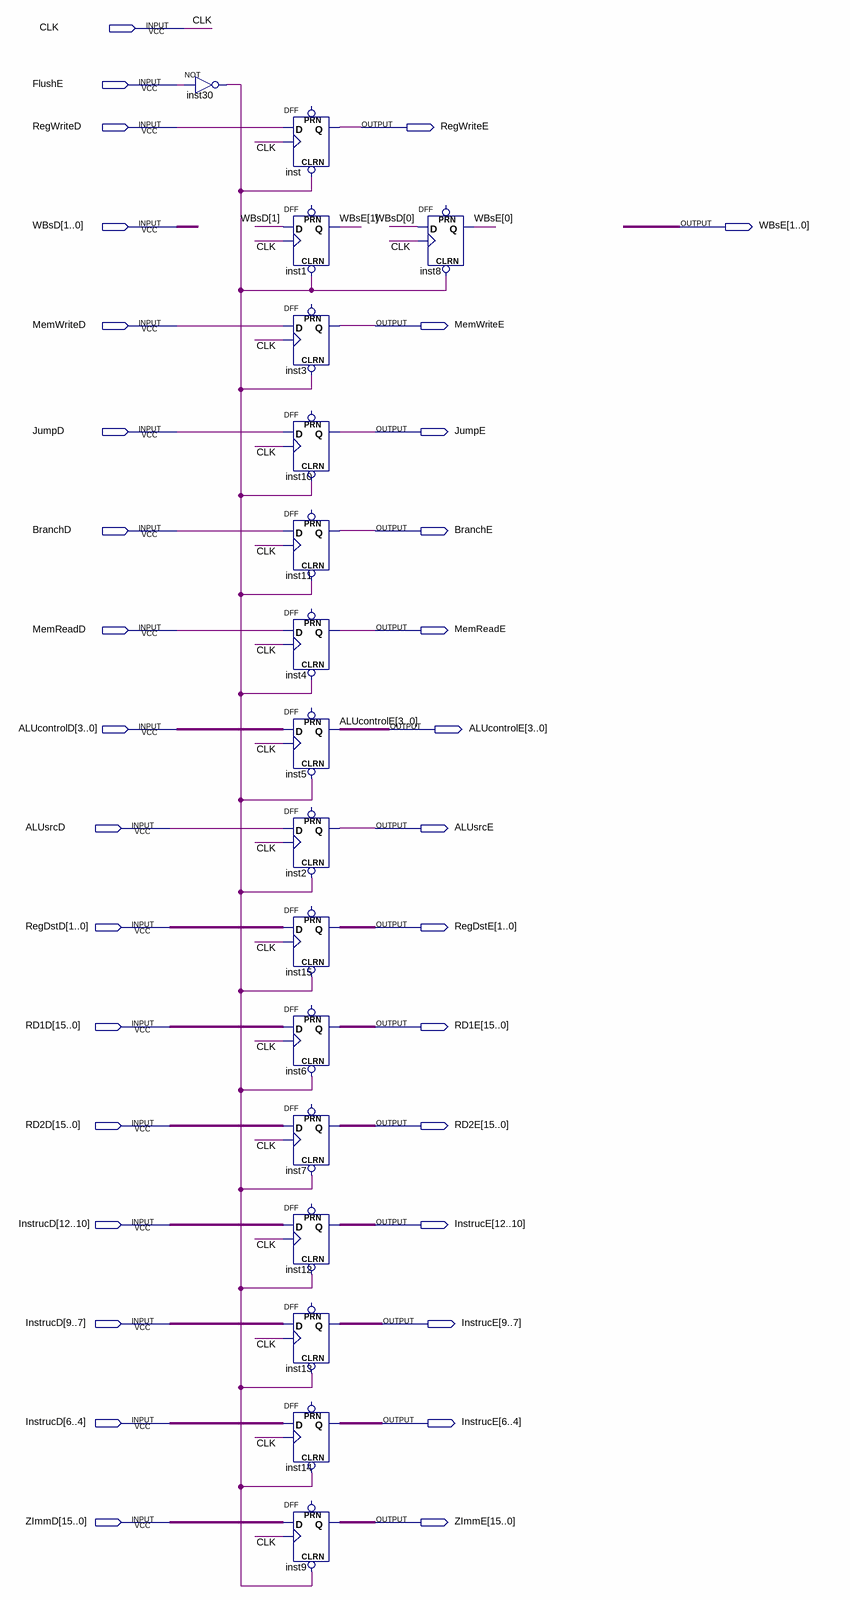
[diagram p0: schematic sheet]
// Quartus schematic ID_E.bdf as structural Verilog: 17 symbols, 32 pins
module ID_E (
  input  CLK,
  input  FlushE,
  input  RegWriteD,
  input  [1:0] WBsD,
  input  MemWriteD,
  input  JumpD,
  input  BranchD,
  input  MemReadD,
  input  [3:0] ALUcontrolD,
  input  ALUsrcD,
  input  [1:0] RegDstD,
  input  [15:0] RD1D,
  input  [15:0] RD2D,
  input  [12:4] InstrucD,
  input  [15:0] ZImmD,
  output RegWriteE,
  output [1:0] WBsE,
  output MemWriteE,
  output JumpE,
  output BranchE,
  output MemReadE,
  output [3:0] ALUcontrolE,
  output ALUsrcE,
  output [1:0] RegDstE,
  output [15:0] RD1E,
  output [15:0] RD2E,
  output [12:4] InstrucE,
  output [15:0] ZImmE
);

  wire inst30_out;

  not inst30 (inst30_out, FlushE);
  DFF inst (.CLRN(inst30_out), .CLK(CLK), .D(RegWriteD), .Q(RegWriteE));  // open: PRN
  DFF inst1 (.CLRN(inst30_out), .CLK(CLK), .D(WBsD[1]), .Q(WBsE[1]));  // open: PRN
  DFF inst3 (.CLRN(inst30_out), .CLK(CLK), .D(MemWriteD), .Q(MemWriteE));  // open: PRN
  DFF inst10 (.CLRN(inst30_out), .CLK(CLK), .D(JumpD), .Q(JumpE));  // open: PRN
  DFF inst11 (.CLRN(inst30_out), .CLK(CLK), .D(BranchD), .Q(BranchE));  // open: PRN
  DFF inst4 (.CLRN(inst30_out), .CLK(CLK), .D(MemReadD), .Q(MemReadE));  // open: PRN
  DFF inst5[3:0] (.CLRN(inst30_out), .CLK(CLK), .D(ALUcontrolD), .Q(ALUcontrolE));  // open: PRN
  DFF inst2 (.CLRN(inst30_out), .CLK(CLK), .D(ALUsrcD), .Q(ALUsrcE));  // open: PRN
  DFF inst15[1:0] (.CLRN(inst30_out), .CLK(CLK), .D(RegDstD), .Q(RegDstE));  // open: PRN
  DFF inst6[15:0] (.CLRN(inst30_out), .CLK(CLK), .D(RD1D), .Q(RD1E));  // open: PRN
  DFF inst7[15:0] (.CLRN(inst30_out), .CLK(CLK), .D(RD2D), .Q(RD2E));  // open: PRN
  DFF inst12[2:0] (.CLRN(inst30_out), .CLK(CLK), .D(InstrucD[12:10]), .Q(InstrucE[12:10]));  // open: PRN
  DFF inst13[2:0] (.CLRN(inst30_out), .CLK(CLK), .D(InstrucD[9:7]), .Q(InstrucE[9:7]));  // open: PRN
  DFF inst14[2:0] (.CLRN(inst30_out), .CLK(CLK), .D(InstrucD[6:4]), .Q(InstrucE[6:4]));  // open: PRN
  DFF inst9[15:0] (.CLRN(inst30_out), .CLK(CLK), .D(ZImmD), .Q(ZImmE));  // open: PRN
  DFF inst8 (.CLRN(inst30_out), .CLK(CLK), .D(WBsD[0]), .Q(WBsE[0]));  // open: PRN
endmodule
